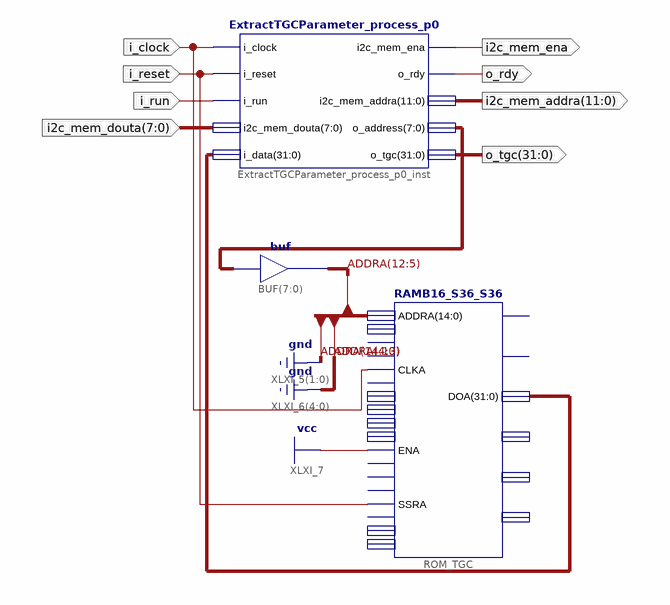
[diagram p0: schematic sheet 1]
// Xilinx ISE schematic ExtractTGCParameter.sch (spartan3e) as structural Verilog: 3 symbols, 8 ports
module ExtractTGCParameter (
  input  i_clock,
  input  i_reset,
  input  i_run,
  input  [7:0] i2c_mem_douta,
  output i2c_mem_ena,
  output o_rdy,
  output [11:0] i2c_mem_addra,
  output [31:0] o_tgc
);

  wire [7:0] XLXN_12;
  wire [12:5] ADDRA;
  wire [31:0] XLXN_13;

  RAMB16_S36_S36 #(.INIT_07("3ffc00003ff800003ff400003ff000003fec00003fe800003fe400003fe00000"), .INIT_06("3fdc00003fd800003fd400003fd000003fcc00003fc800003fc400003fc00000"), .INIT_05("3fbc00003fb800003fb400003fb000003fac00003fa800003fa400003fa00000"), .INIT_04("3f9c00003f9800003f9400003f9000003f8c00003f8800003f8400003f800000"), .INIT_03("3f7800003f7000003f6800003f6000003f5800003f5000003f4800003f400000"), .INIT_02("3f3800003f3000003f2800003f2000003f1800003f1000003f0800003f000000"), .INIT_01("3ef000003ee000003ed000003ec000003eb000003ea000003e9000003e800000"), .INIT_00("3e6000003e4000003e2000003e0000003dc000003d8000003d00000022000000"), .WRITE_WIDTH_B(36), .WRITE_WIDTH_A(36), .WRITE_MODE_B("READ_FIRST"), .WRITE_MODE_A("READ_FIRST"), .READ_WIDTH_B(36), .READ_WIDTH_A(36), .INIT_1F("bd000000bd800000bdc00000be000000be200000be400000be600000be800000"), .INIT_1E("be900000bea00000beb00000bec00000bed00000bee00000bef00000bf000000"), .INIT_1D("bf080000bf100000bf180000bf200000bf280000bf300000bf380000bf400000"), .INIT_1C("bf480000bf500000bf580000bf600000bf680000bf700000bf780000bf800000"), .INIT_1B("bf840000bf880000bf8c0000bf900000bf940000bf980000bf9c0000bfa00000"), .INIT_1A("bfa40000bfa80000bfac0000bfb00000bfb40000bfb80000bfbc0000bfc00000"), .INIT_19("bfc40000bfc80000bfcc0000bfd00000bfd40000bfd80000bfdc0000bfe00000"), .INIT_18("bfe40000bfe80000bfec0000bff00000bff40000bff80000bffc0000c0000000"), .INIT_17("c0020000c0040000c0060000c0080000c00a0000c00c0000c00e0000c0100000"), .INIT_16("c0120000c0140000c0160000c0180000c01a0000c01c0000c01e0000c0200000"), .INIT_15("c0220000c0240000c0260000c0280000c02a0000c02c0000c02e0000c0300000"), .INIT_14("c0320000c0340000c0360000c0380000c03a0000c03c0000c03e0000c0400000"), .INIT_13("c0420000c0440000c0460000c0480000c04a0000c04c0000c04e0000c0500000"), .INIT_12("c0520000c0540000c0560000c0580000c05a0000c05c0000c05e0000c0600000"), .INIT_11("c0620000c0640000c0660000c0680000c06a0000c06c0000c06e0000c0700000"), .INIT_10("c0720000c0740000c0760000c0780000c07a0000c07c0000c07e0000c0800000"), .INIT_0F("407e0000407c0000407a00004078000040760000407400004072000040700000"), .INIT_0E("406e0000406c0000406a00004068000040660000406400004062000040600000"), .INIT_0D("405e0000405c0000405a00004058000040560000405400004052000040500000"), .INIT_0C("404e0000404c0000404a00004048000040460000404400004042000040400000"), .INIT_0B("403e0000403c0000403a00004038000040360000403400004032000040300000"), .INIT_0A("402e0000402c0000402a00004028000040260000402400004022000040200000"), .INIT_09("401e0000401c0000401a00004018000040160000401400004012000040100000"), .INIT_08("400e0000400c0000400a00004008000040060000400400004002000040000000")) ROM_TGC (
    .ADDRA({2'b00, ADDRA, {5{1'b0}}}), .CLKA(i_clock), .ENA(1'b1), .SSRA(i_reset), .DOA(XLXN_13));  // open: ADDRB, CASCADEINA, CASCADEINB, CLKB, DIA, DIB, DIPA, DIPB, REGCEA, REGCEB, ENB, SSRB, WEA, WEB, CASCADEOUTA, CASCADEOUTB, DOB, DOPA, DOPB
  assign ADDRA = XLXN_12;  // buf BUF[7..0], 8 bits wide
  ExtractTGCParameter_process_p0 ExtractTGCParameter_process_p0_inst (
    .i_clock(i_clock), .i_reset(i_reset), .i_run(i_run), .i2c_mem_douta(i2c_mem_douta), .i_data(XLXN_13),
    .i2c_mem_ena(i2c_mem_ena), .o_rdy(o_rdy), .i2c_mem_addra(i2c_mem_addra), .o_address(XLXN_12),
    .o_tgc(o_tgc));
endmodule
